# EAGLE schematic RFID-Projekt (EAGLE 9.6.1)
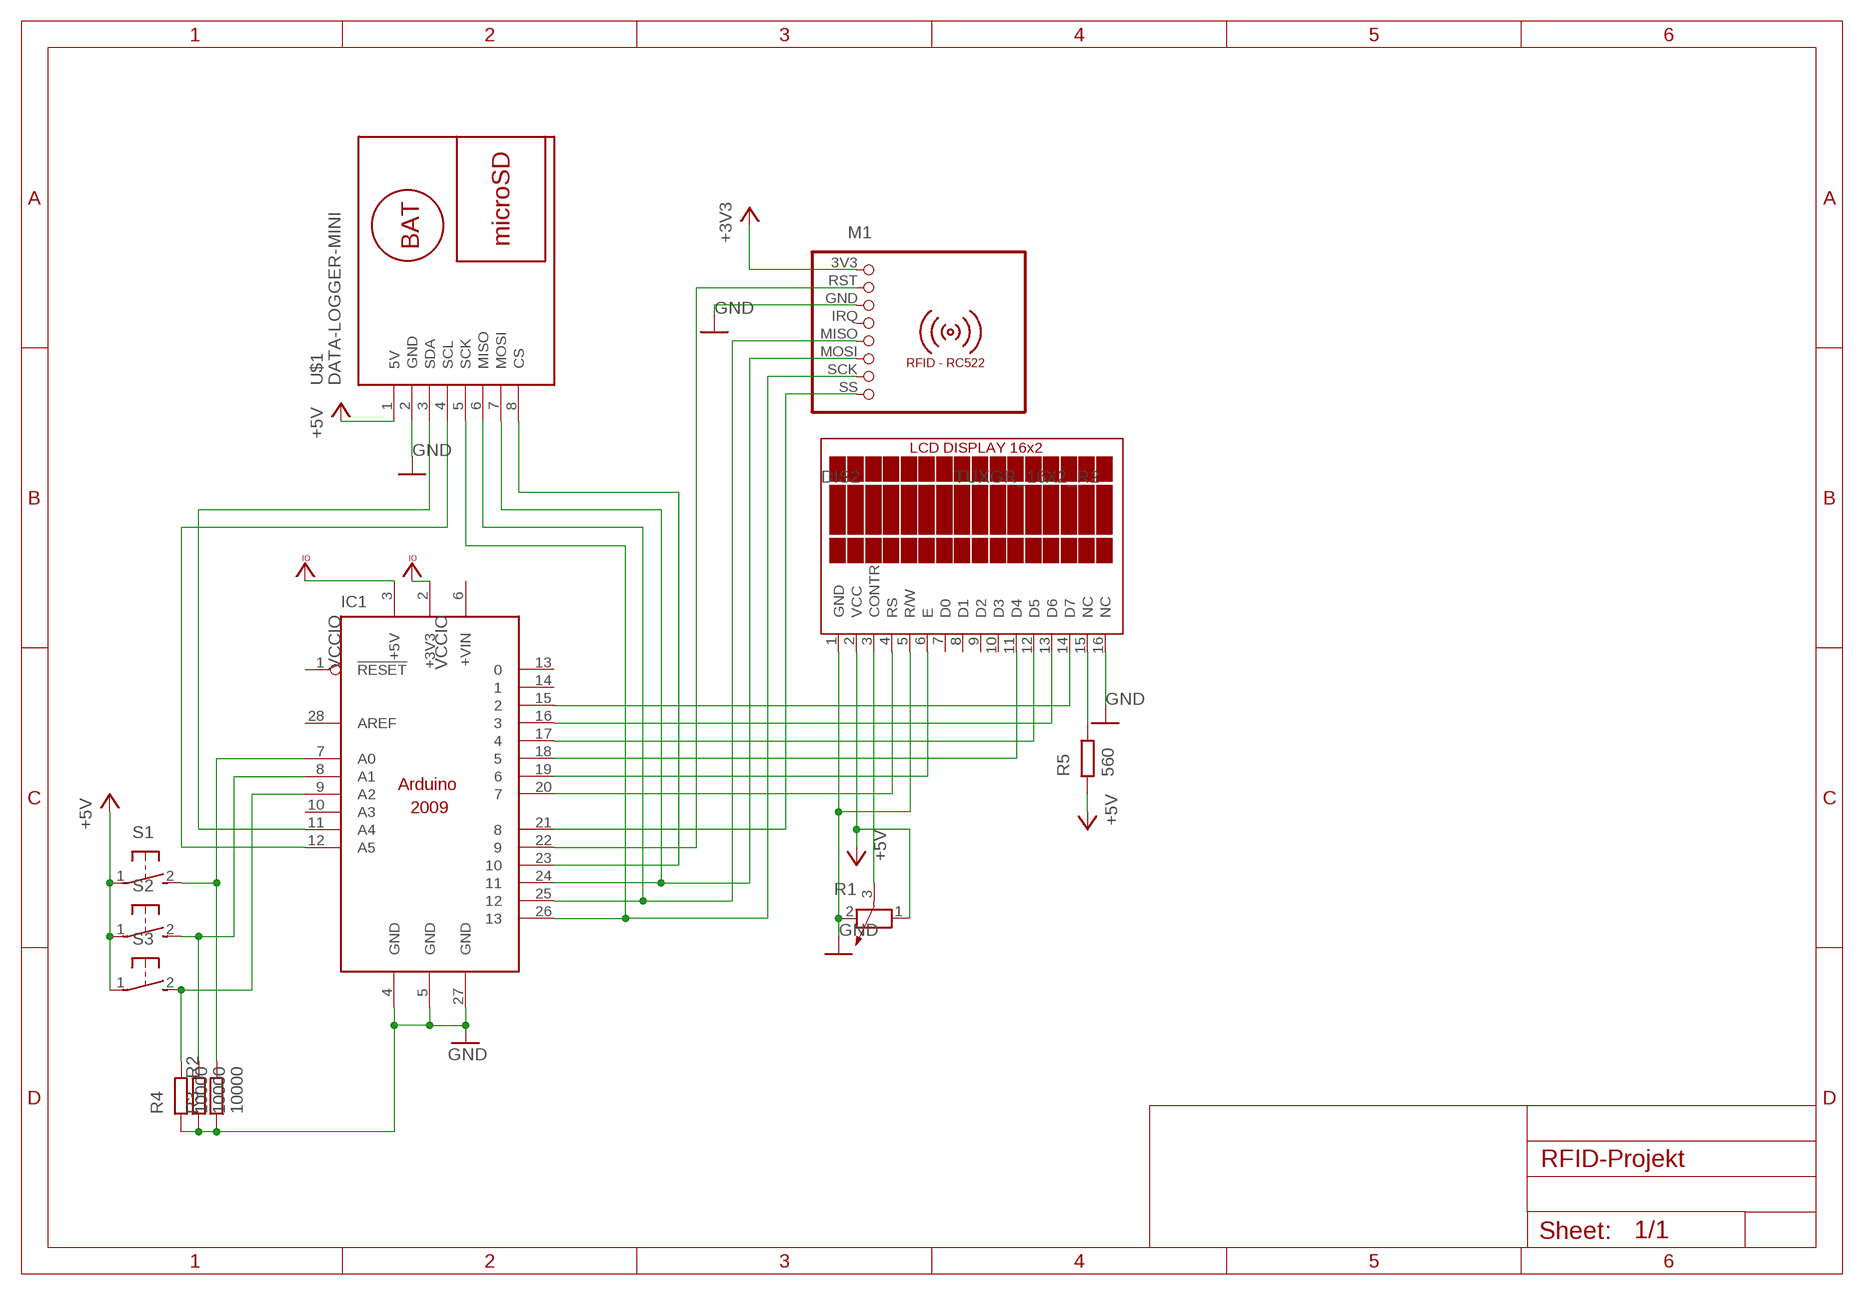
[diagram p0: schematic, sheet 1]

## Parts
DIS2  TUXGR_16X2_R2  [TUXGR_16X2_R2]
IC1  ARDUINO2009_10  [ARDUINO2009]
M1  RFID-RC522  [RFID-RC522]
R1  POTENTIOMETER_PT-10  [PT-10]
R2  10000  R  (no package)
R3  10000  R  (no package)
R4  10000  R  (no package)
R5  560  R  (no package)
S1  31-XX  [B3F-31XX]
S2  31-XX  [B3F-31XX]
S3  31-XX  [B3F-31XX]
U$1  DATA-LOGGER-MINI  [DATA-LOGGER-MINI]

## Nets
+3V3: M1.3V3
+5V: DIS2.2(VCC) R1.1 R5.1 S1.1(P) S2.1(P) S3.1(P) U$1.1(5V)
GND: DIS2.1(GND) DIS2.5(R/W) DIS2.16(NC) IC1.4(GND) IC1.5(GND) IC1.27(GND) M1.GND R1.2 R2.1 R3.1 R4.1 U$1.2(GND)
N$1: IC1.12(A5) U$1.4(SCL)
N$2: IC1.11(A4) U$1.3(SDA)
N$3: IC1.25 M1.MISO U$1.6(MISO)
N$4: IC1.24 M1.MOSI U$1.7(MOSI)
N$5: IC1.26 M1.SCK U$1.5(SCK)
N$6: IC1.23 U$1.8(CS)
N$7: IC1.8(A1) R2.2 S2.2(S)
N$8: IC1.7(A0) R3.2 S1.2(S)
N$9: IC1.9(A2) R4.2 S3.2(S)
N$10: DIS2.15(NC) R5.2
N$11: IC1.22 M1.RST
N$12: IC1.21 M1.SS
N$13: DIS2.3(CONTR) R1.3
N$14: DIS2.12(D5) IC1.17
N$15: DIS2.11(D4) IC1.18
N$16: DIS2.13(D6) IC1.16
N$17: DIS2.14(D7) IC1.15
N$18: DIS2.6(E) IC1.19
N$20: DIS2.4(RS) IC1.20
VCCIO: IC1.2(+3V3) IC1.3(+5V)
Unconnected: DIS2.7(D0) DIS2.8(D1) DIS2.9(D2) DIS2.10(D3) IC1.1(!RESET) IC1.6(+VIN) IC1.10(A3) IC1.13 IC1.14 IC1.28(AREF) M1.IRQ

## Library data of the parts
DIS2 = display-lcd 16x4:TUXGR_16X2_R2: Tuxgraphics LCD display 16x2 characters reflective, without background light Source: tuxgr_12x2_r2.pdf; OC_FARNELL: unknown; OC_NEWARK: unknown
IC1 = arduino:ARDUINO2009_1: The Arduino Duemilanove ("2009") is a microcontroller board based on the ATmega168 or ATmega328. - 14 digital input/output pins (of which 6 can be used as PWM outputs) - 6 analog inputs, a 16 MHz crystal oscillator - USB connection - power jack - ISP header - reset button It contains everything needed to support the microcontroller; simply connect it to a computer with a USB cable or power it with a AC-to-DC adapter or battery to get started http://arduino.cc/en/Main/ArduinoBoardDuemilanove
M1 = mfrc522-module:RFID-RC522: RFID-RC522 MFRC-522 based breakout board
R1 = rcl:POTENTIOMETER_: Potentiometer; SPICEMODEL: POT; SPICEPREFIX: X
R2-R5 = ngspice-simulation:R: RESISTOR
S1-S3 = switch-omron:31-XX: OMRON SWITCH; MPN: B3F-3100; OC_FARNELL: 959704; OC_NEWARK: 36M3582
U$1 = diy-modules:DATA-LOGGER-MINI: Mini Data Logger with microSD card and battery powered RTC based on DS1307 chip Arduino library for DS1307 and description are available here: https://www.pjrc.com/teensy/td_libs_DS1307RTC.html Tutorial how to use SD card with Arduino: https://www.arduino.cc/en/reference/SD Click here to find device on ebay.com <http://www.ebay.com/sch/mini+data+logger+arduino>